# EAGLE schematic evpr (EAGLE 9.5.2)
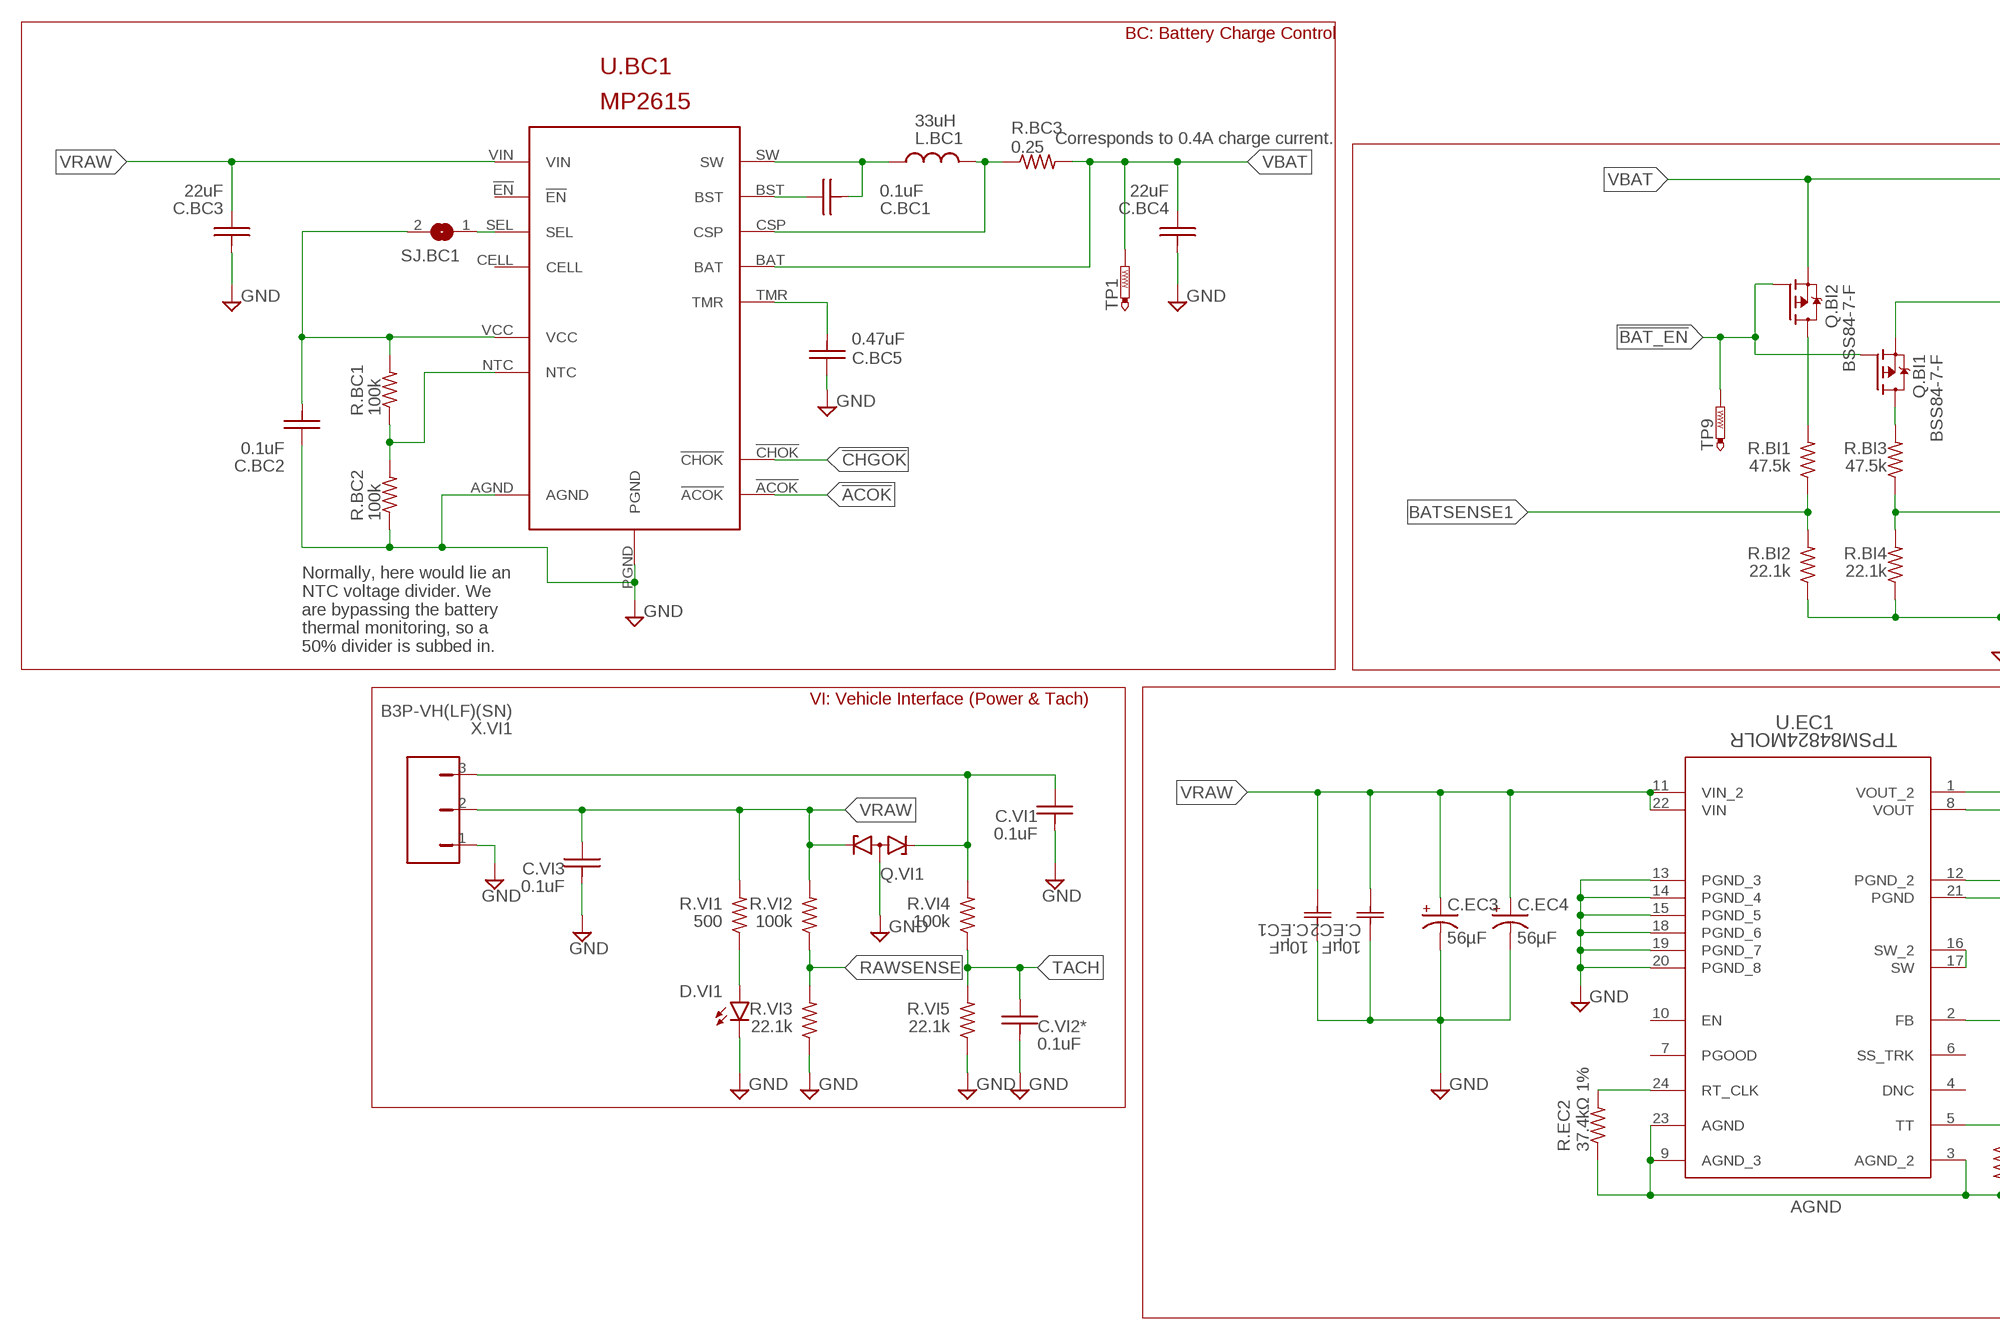
[diagram p0: schematic, sheet 1, part 1 of 2]
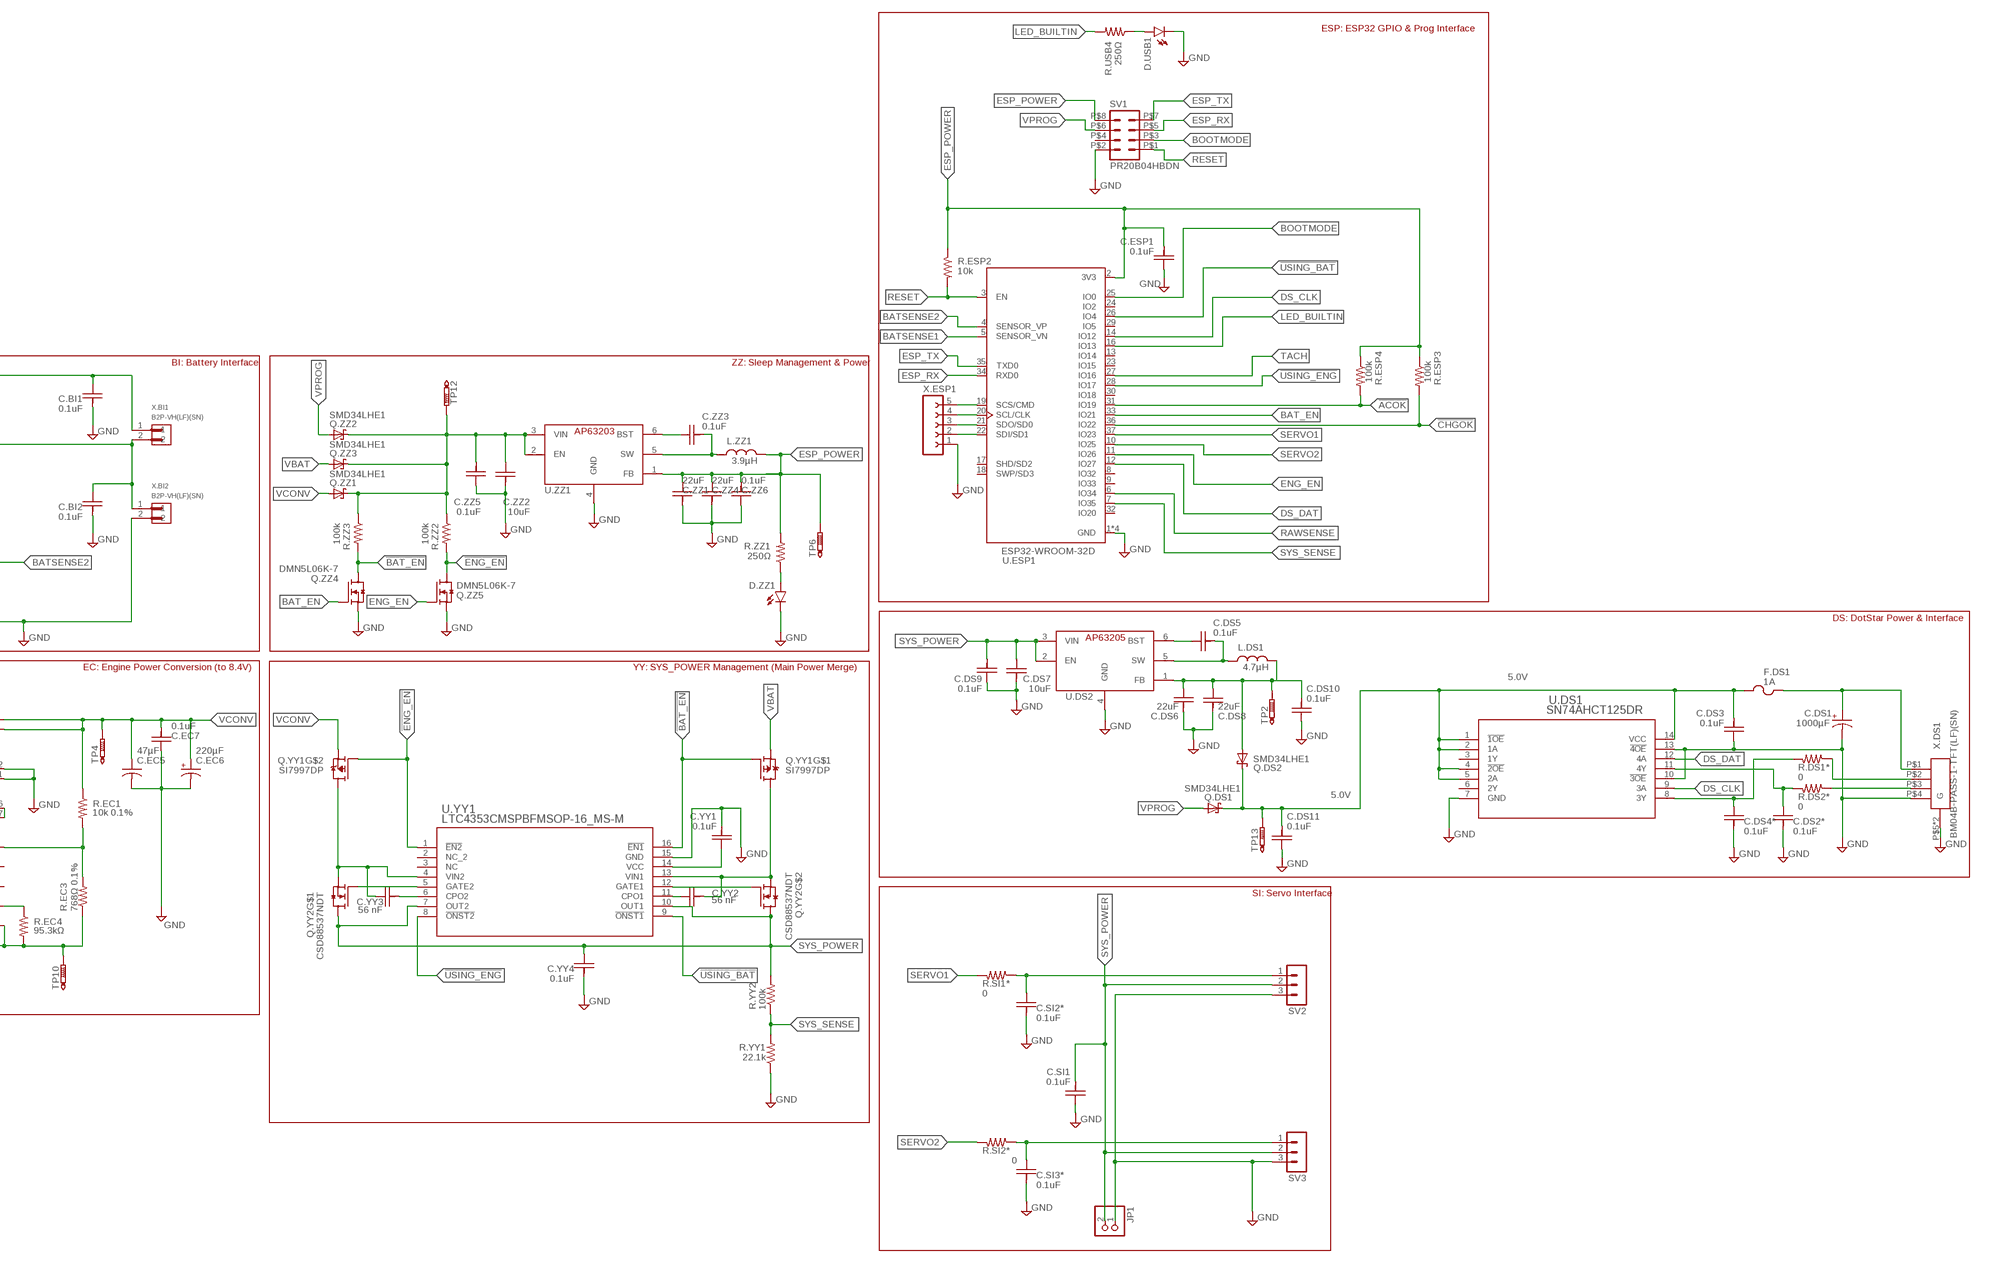
[diagram p1: schematic, sheet 1, part 2 of 2]

## Parts
C.BC1  0.1uF  C0603  [C0603]
C.BC2  0.1uF  C0603  [C0603]
C.BC3  22uF  C0603  [C0603]
C.BC4  22uF  C0603  [C0603]
C.BC5  0.47uF  C0603  [C0603]
C.BI1  0.1uF  C0603  [C0603]
C.BI2  0.1uF  C0603  [C0603]
C.DS1  1000µF  810RADCAP  [810RADCAN]
C.DS2*  0.1uF  C0603  [C0603]
C.DS3  0.1uF  C0603  [C0603]
C.DS4*  0.1uF  C0603  [C0603]
C.DS5  0.1uF  C0603  [C0603]
C.DS6  22uF  C0603  [C0603]
C.DS7  10uF  C0603  [C0603]
C.DS8  22uF  C0603  [C0603]
C.DS9  0.1uF  C0603  [C0603]
C.DS10  0.1uF  C0603  [C0603]
C.DS11  0.1uF  C0603  [C0603]
C.EC1  10µF  C3225X7R1E106K250AC  [CAP_3225]
C.EC2  10µF  C3225X7R1E106K250AC  [CAP_3225]
C.EC3  56µF  6.3MMCAP  [OSCON_SVPF_6.3MM]
C.EC4  56µF  6.3MMCAP  [OSCON_SVPF_6.3MM]
C.EC5  47µF  C-USC1210  [C1210]
C.EC6  220µF  WURTH875115352003  [C6CYLCAP]
C.EC7  0.1uF  C0603  [C0603]
C.ESP1  0.1uF  C0603  [C0603]
C.SI1  0.1uF  C0603  [C0603]
C.SI2*  0.1uF  C0603  [C0603]
C.SI3*  0.1uF  C0603  [C0603]
C.VI1  0.1uF  C0603  [C0603]
C.VI2*  0.1uF  C0603  [C0603]
C.VI3  0.1uF  C0603  [C0603]
C.YY1  0.1uF  C0603  [C0603]
C.YY2  56 nF  C0603  [C0603]
C.YY3  56 nF  C0603  [C0603]
C.YY4  0.1uF  C0603  [C0603]
C.ZZ1  22uF  C0603  [C0603]
C.ZZ2  10uF  C0603  [C0603]
C.ZZ3  0.1uF  C0603  [C0603]
C.ZZ4  22uF  C0603  [C0603]
C.ZZ5  0.1uF  C0603  [C0603]
C.ZZ6  0.1uF  C0603  [C0603]
D.USB1  LEDCHIP-LED0805  [CHIP-LED0805]
D.VI1  LEDCHIP-LED0805  [CHIP-LED0805]
D.ZZ1  LEDCHIP-LED0805  [CHIP-LED0805]
F.DS1  1A  C1Q_1C1-M  [C1-M]
JP1  PINHD-1X2  [1X02]
L.BC1  33uH  SRN5040TA-330M  [SRN5040TA]
L.DS1  4.7µH  SRR4818A-XXXX  [SRR4818A-XXXX]
L.ZZ1  3.9µH  SRR4818A-XXXX  [SRR4818A-XXXX]
Q.BI1  BSS84-7-F  [SOT23]
Q.BI2  BSS84-7-F  [SOT23]
Q.DS1  SMD34LHE1  [SOD-123HE1]
Q.DS2  SMD34LHE1  [SOD-123HE1]
Q.VI1  VESD16A2-03G-G3-08  [SOT23]
Q.YY1  SI7997DP  [POWERPAK_SO8DUAL]
Q.YY2  CSD88537NDT  [SOIC8]
Q.ZZ1  SMD34LHE1  [SOD-123HE1]
Q.ZZ2  SMD34LHE1  [SOD-123HE1]
Q.ZZ3  SMD34LHE1  [SOD-123HE1]
Q.ZZ4  DMN5L06K-7  [SOT23]
Q.ZZ5  DMN5L06K-7  [SOT23]
R.BC1  100k  R0603  [R0603]
R.BC2  100k  R0603  [R0603]
R.BC3  0.25  R0603  [R0603]
R.BI1  47.5k  R0603  [R0603]
R.BI2  22.1k  R0603  [R0603]
R.BI3  47.5k  R0603  [R0603]
R.BI4  22.1k  R0603  [R0603]
R.DS1*  0  R0603  [R0603]
R.DS2*  0  R0603  [R0603]
R.EC1  10k 0.1%  R0603  [R0603]
R.EC2  37.4kΩ 1%  R0603  [R0603]
R.EC3  768Ω 0.1%  R0603  [R0603]
R.EC4  95.3kΩ  R0603  [R0603]
R.ESP2  10k  R0603  [R0603]
R.ESP3  100k  R0603  [R0603]
R.ESP4  100k  R0603  [R0603]
R.SI1*  0  R0603  [R0603]
R.SI2*  0  R0603  [R0603]
R.USB4  250Ω  R0603  [R0603]
R.VI1  500  R0603  [R0603]
R.VI2  100k  R0603  [R0603]
R.VI3  22.1k  R0603  [R0603]
R.VI4  100k  R0603  [R0603]
R.VI5  22.1k  R0603  [R0603]
R.YY1  22.1k  R0603  [R0603]
R.YY2  100k  R0603  [R0603]
R.ZZ1  250Ω  R0603  [R0603]
R.ZZ2  100k  R0603  [R0603]
R.ZZ3  100k  R0603  [R0603]
SJ.BC1  SJ  [SJ]
SV1  PR20B04HBDN  [PR20B04HBDN]
SV2  MA03-1  [MA03-1]
SV3  MA03-1  [MA03-1]
TP1  PTR1TP10R  [TP10R]
TP2  PTR1TP10R  [TP10R]
TP4  PTR1TP10R  [TP10R]
TP6  PTR1TP10R  [TP10R]
TP9  PTR1TP10R  [TP10R]
TP10  PTR1TP10R  [TP10R]
TP12  PTR1TP10R  [TP10R]
TP13  PTR1TP10R  [TP10R]
U.BC1  MP2615  [QFN16]
U.DS1  SN74AHCT125DR  [D14]
U.DS2  AP63205  [TSOT23-6]
U.EC1  TPSM84824MOLR  [MOL0024A]
U.ESP1  ESP32-WROOM-32D  [MODULE_ESP32-WROOM-32D]
U.YY1  LTC4353CMSPBFMSOP-16_MS-M  [MSOP-16_MS-M]
U.ZZ1  AP63203  [TSOT23-6]
X.BI1  B2P-VH(LF)(SN)  [JST_B2P-VH(LF)(SN)]
X.BI2  B2P-VH(LF)(SN)  [JST_B2P-VH(LF)(SN)]
X.DS1  BM04B-PASS-1-TFT(LF)(SN)  [BM04B-PASS-1-TFT(LF)(SN)]
X.ESP1  FE05-1  [FE05-1]
X.VI1  B3P-VH(LF)(SN)  [B3P-VH]

## Nets
5.0V: C.DS3.2 C.DS11.2 F.DS1.1 Q.DS1.C Q.DS2.C TP13.TP U.DS1.1(!1OE) U.DS1.2(1A) U.DS1.4(!2OE) U.DS1.5(2A) U.DS1.14(VCC)
!ACOK: R.ESP4.2 U.BC1.!ACOK U.ESP1.31(IO19)
!BAT_EN: Q.BI1.1(G) Q.BI2.1(G) Q.YY1.P$2(G) Q.ZZ4.3(D) R.ZZ3.2 TP9.TP U.YY1.16(!EN1)
!CHGOK: R.ESP3.2 U.BC1.!CHOK U.ESP1.36(IO22)
!ENG_EN: Q.YY1.P$4(G) Q.ZZ5.3(D) R.ZZ2.2 U.YY1.1(!EN2)
!USING_BAT: U.ESP1.26(IO4) U.YY1.9(!ONST1)
!USING_ENG: U.ESP1.28(IO17) U.YY1.8(!ONST2)
AGND: R.EC2.1 R.EC3.1 R.EC4.2 TP10.TP U.EC1.3(AGND_2) U.EC1.9(AGND_3) U.EC1.23(AGND)
BAT_EN: Q.ZZ4.1(G) U.ESP1.33(IO21)
BATSENSE1: R.BI1.1 R.BI2.2 U.ESP1.5(SENSOR_VN)
BATSENSE2: R.BI3.1 R.BI4.2 U.ESP1.4(SENSOR_VP)
BOOTMODE: SV1.P$3 U.ESP1.25(IO0)
DS_CLK: U.DS1.9(3A) U.ESP1.14(IO12)
DS_DAT: U.DS1.12(4A) U.ESP1.12(IO27)
ENG_EN: Q.ZZ5.1(G) U.ESP1.11(IO26)
ESP_POWER: C.ESP1.2 C.ZZ1.1 C.ZZ4.1 C.ZZ6.2 L.ZZ1.P$2 R.ESP2.1 R.ESP3.1 R.ESP4.1 R.ZZ1.2 SV1.P$8 TP6.TP U.ESP1.2(3V3) U.ZZ1.1(FB)
ESP_RX: SV1.P$5 U.ESP1.34(RXD0)
ESP_TX: SV1.P$7 U.ESP1.35(TXD0)
GND: C.BC2.1 C.BC3.2 C.BC4.2 C.BC5.1 C.BI1.2 C.BI2.2 C.DS1.C$2(-) C.DS2*.2 C.DS3.1 C.DS4*.2 C.DS6.2 C.DS7.2 C.DS8.2 C.DS9.1 C.DS10.1 C.DS11.1 C.EC1.1 C.EC2.1 C.EC3.- C.EC4.- C.EC5.2 C.EC6.P$1(-) C.EC7.1 C.ESP1.1 C.SI1.1 C.SI2*.2 C.SI3*.2 C.VI1.2 C.VI2*.2 C.VI3.2 C.YY1.2 C.YY4.2 C.ZZ1.2 C.ZZ2.2 C.ZZ4.2 C.ZZ5.1 C.ZZ6.1 D.USB1.C D.VI1.C D.ZZ1.C JP1.1 Q.VI1.3(AA) Q.ZZ4.2(S) Q.ZZ5.2(S) R.BC2.1 R.BI2.1 R.BI4.1 R.VI3.1 R.VI5.1 R.YY1.1 SV1.P$2 SV2.3 SV3.3 U.BC1.AGND U.BC1.PGND U.DS1.7(GND) U.DS1.10(!3OE) U.DS1.13(!4OE) U.DS2.4(GND) U.EC1.12(PGND_2) U.EC1.13(PGND_3) U.EC1.14(PGND_4) U.EC1.15(PGND_5) U.EC1.18(PGND_6) U.EC1.19(PGND_7) U.EC1.20(PGND_8) U.EC1.21(PGND) U.ESP1.1(GND) U.ESP1.15(GND) U.ESP1.38(GND) U.ESP1.39(GND) U.YY1.15(GND) U.ZZ1.4(GND) X.BI2.2 X.DS1.P$4 X.DS1.P$5(G) X.DS1.P$6(G) X.ESP1.1 X.VI1.1
LED_BUILTIN: R.USB4.2 U.ESP1.16(IO13)
N$3: R.EC1.2 R.EC3.2 U.EC1.2(FB)
N$4: Q.YY2.4(G) U.YY1.12(GATE1)
N$5: C.YY3.1 Q.YY1.D$2A(D) Q.YY2.1(S) U.YY1.4(VIN2)
N$6: C.YY2.2 Q.YY1.D$1B(D) Q.YY2.3(S) U.YY1.13(VIN1)
N$7: C.BC5.2 U.BC1.TMR
N$8: C.BI2.1 Q.BI1.2(S) X.BI1.2 X.BI2.1
N$9: C.ZZ2.1 C.ZZ5.2 Q.ZZ1.C Q.ZZ2.C Q.ZZ3.C R.ZZ2.1 R.ZZ3.1 TP12.TP U.ZZ1.2(EN) U.ZZ1.3(VIN)
N$10: Q.YY2.2(G) U.YY1.5(GATE2)
N$11: C.SI2*.1 R.SI1*.1 SV2.1
N$12: C.SI3*.1 R.SI2*.1 SV3.1
N$13: Q.BI2.3(D) R.BI1.2
N$14: C.ZZ3.1 U.ZZ1.6(BST)
N$15: U.EC1.16(SW_2) U.EC1.17(SW)
N$17: R.EC2.2 U.EC1.24(RT_CLK)
N$22: C.DS2*.1 R.DS2*.2 U.DS1.11(4Y)
N$23: D.VI1.A R.VI1.1
N$24: D.USB1.A R.USB4.1
N$26: C.ZZ3.2 L.ZZ1.P$1 U.ZZ1.5(SW)
N$27: C.DS4*.1 R.DS1*.2 U.DS1.8(3Y)
N$28: C.DS1.A$1(+) F.DS1.2 X.DS1.P$1
N$29: C.DS5.1 U.DS2.6(BST)
N$30: R.DS1*.1 X.DS1.P$2
N$31: R.EC4.1 U.EC1.5(TT)
N$32: C.YY1.1 U.YY1.14(VCC)
N$33: Q.BI1.3(D) R.BI3.2
N$36: D.ZZ1.A R.ZZ1.1
N$37: C.YY2.1 U.YY1.11(CPO1)
N$38: C.YY3.2 U.YY1.6(CPO2)
N$42: R.DS2*.1 X.DS1.P$3
N$48: R.BC1.1 R.BC2.2 U.BC1.NTC
N$49: U.ESP1.19(SCS/CMD) X.ESP1.5
N$50: C.DS5.2 L.DS1.P$1 U.DS2.5(SW)
N$51: C.DS6.1 C.DS8.1 C.DS10.2 L.DS1.P$2 Q.DS2.A TP2.TP U.DS2.1(FB)
N$52: C.BC2.2 R.BC1.2 SJ.BC1.2 U.BC1.VCC
N$56: L.BC1.P$2 R.BC3.1 U.BC1.CSP
N$58: SJ.BC1.1 U.BC1.SEL
N$59: C.BC1.1 U.BC1.BST
N$60: C.BC1.2 L.BC1.P$1 U.BC1.SW
N$66: U.ESP1.20(SCL/CLK) X.ESP1.4
N$68: U.ESP1.21(SDO/SD0) X.ESP1.3
N$70: U.ESP1.22(SDI/SD1) X.ESP1.2
RAWSENSE: R.VI2.1 R.VI3.2 U.ESP1.6(IO34)
RESET: R.ESP2.2 SV1.P$1 U.ESP1.3(EN)
SERVO1: R.SI1*.2 U.ESP1.37(IO23)
SERVO2: R.SI2*.2 U.ESP1.10(IO25)
SYS_POWER: C.DS7.1 C.DS9.2 C.SI1.2 C.YY4.1 JP1.2 Q.YY2.5(D) Q.YY2.6(D) Q.YY2.7(D) Q.YY2.8(D) R.YY2.2 SV2.2 SV3.2 U.DS2.2(EN) U.DS2.3(VIN) U.YY1.7(OUT2) U.YY1.10(OUT1)
SYS_SENSE: R.YY1.2 R.YY2.1 U.ESP1.7(IO35)
TACH: C.VI2*.1 R.VI4.1 R.VI5.2 U.ESP1.27(IO16)
TACH_RAW: C.VI1.1 Q.VI1.2(K1) R.VI4.2 X.VI1.3
VBAT: C.BC4.1 C.BI1.1 Q.BI2.2(S) Q.YY1.P$1(S) Q.ZZ3.A R.BC3.2 TP1.TP U.BC1.BAT X.BI1.1
VCONV: C.EC5.1 C.EC6.P$2(+) C.EC7.2 Q.YY1.P$3(S) Q.ZZ1.A R.EC1.1 TP4.TP U.EC1.1(VOUT_2) U.EC1.8(VOUT)
VPROG: Q.DS1.A Q.ZZ2.A SV1.P$6
VRAW: C.BC3.1 C.EC1.2 C.EC2.2 C.EC3.+ C.EC4.+ C.VI3.1 Q.VI1.1(K2) R.VI1.2 R.VI2.2 U.BC1.VIN U.EC1.11(VIN_2) U.EC1.22(VIN) X.VI1.2
Unconnected: SV1.P$4 U.BC1.!EN U.BC1.CELL U.DS1.3(1Y) U.DS1.6(2Y) U.EC1.4(DNC) U.EC1.6(SS_TRK) U.EC1.7(PGOOD) U.EC1.10(EN) U.ESP1.8(IO32) U.ESP1.9(IO33) U.ESP1.13(IO14) U.ESP1.17(SHD/SD2) U.ESP1.18(SWP/SD3) U.ESP1.23(IO15) U.ESP1.24(IO2) U.ESP1.29(IO5) U.ESP1.30(IO18) U.ESP1.32(IO20) U.YY1.2(NC_2) U.YY1.3(NC)

## Notes on the sheet
- ESP: ESP32 GPIO & Prog Interface
- BC: Battery Charge Control
- Corresponds to 0.4A charge current.
- BI: Battery Interface | ZZ: Sleep Management & Power
- DS: DotStar Power & Interface
- Normally, here would lie an
  NTC voltage divider. We
  are bypassing the battery
  thermal monitoring, so a 
  50% divider is subbed in.
- VI: Vehicle Interface (Power & Tach) | EC: Engine Power Conversion (to 8.4V) | YY: SYS_POWER Management (Main Power Merge)
- SI: Servo Interface

## Library data of the parts
C.BC1 C.BC2 C.BI1 C.BI2 C.DS2* C.DS3 C.DS4* C.DS5 C.DS9-C.DS11 C.EC7 C.ESP1 C.SI1 C.SI2* C.SI3* C.VI1 C.VI2* C.VI3 C.YY1 C.YY4 C.ZZ3 C.ZZ5 C.ZZ6 = mccloud:C0603: CAPACITOR, American symbol; COMPONENT: 06033C104JAT2A
C.BC3 C.BC4 C.DS6 C.DS8 C.ZZ1 C.ZZ4 = mccloud:C0603: CAPACITOR, American symbol; COMPONENT: CL10A226MO7JZNC
C.BC5 = mccloud:C0603: CAPACITOR, American symbol; COMPONENT: C0603C474K4PACTU
C.DS1 = mccloud:810RADCAP; COMPONENT: UWT0J102MNL1GS
C.DS7 C.ZZ2 = mccloud:C0603: CAPACITOR, American symbol; COMPONENT: GRM188R61E106MA73J
C.EC1 C.EC2 = mccloud:C3225X7R1E106K250AC; COMPONENT: C3225X7R1E106K250AC
C.EC3 C.EC4 = mccloud:6.3MMCAP; COMPONENT: APXG250ARA560MF61G
C.EC5 = rcl:C-US: CAPACITOR, American symbol; COMPONENT: CL32A476KOJNNNE; SPICEPREFIX: C
C.EC6 = mccloud:WURTH875115352003; COMPONENT: 875075355002
C.YY2 C.YY3 = mccloud:C0603: CAPACITOR, American symbol; COMPONENT: CL10B562KB8NNNC
D.USB1 D.VI1 D.ZZ1 = led:LED: LED OSRAM: - CHIPLED LG R971, LG N971, LY N971, LG Q971, LY Q971, LO R971, LY R971 LH N974, LH R974 LS Q976, LO Q976, LY Q976 LO Q996 - Hyper CHIPLED LW Q18S LB Q993, LB Q99A, LB R99A - SideLED LS A670, LO A670, LY A670, LG A670, LP A670 LB A673, LV A673, LT A673, LW A673 LH A674 LY A675 LS A676, LA A676, LO A676, LY A676, LW A676 LS A679, LY A679, LG A679 - Hyper Micro SIDELED® LS Y876, LA Y876, LO Y876, LY Y876 LT Y87S - SmartLED LW L88C, LW L88S LB L89C, LB L89S, LG L890 LS L89K, LO L89K, LY L89K LS L896, LA L896, LO L896, LY L896 - TOPLED LS T670, LO T670, LY T670, LG T670, LP T670 LSG T670, LSP T670, LSY T670, LOP T670, LYG T670 LG T671, LOG T671, LSG T671 LB T673, LV T673, LT T673, LW T673 LH T674 LS T676, LA T676, LO T676, LY T676, LB T676, LH T676, LSB T676, LW T676 LB T67C, LV T67C, LT T67C, LS T67K, LO T67K, LY T67K, LW E67C LS E67B, LA E67B, LO E67B, LY E67B, LB E67C, LV E67C, LT E67C LW T67C LS T679, LY T679, LG T679 LS T770, LO T770, LY T770, LG T770, LP T770 LB T773, LV T773, LT T773, LW T773 LH T774 LS E675, LA E675, LY E675, LS T675 LS T776, LA T776, LO T776, LY T776, LB T776 LHGB T686 LT T68C, LB T68C - Hyper Mini TOPLED® LB M676 - Mini TOPLED Santana® LG M470 LS M47K, LO M47K, LY M47K Source: http://www.osram.convergy.de LUXEON: - LUMILED® LXK2-PW12-R00, LXK2-PW12-S00, LXK2-PW14-U00, LXK2-PW14-V00 LXK2-PM12-R00, LXK2-PM12-S00, LXK2-PM14-U00 LXK2-PE12-Q00, LXK2-PE12-R00, LXK2-PE12-S00, LXK2-PE14-T00, LXK2-PE14-U00 LXK2-PB12-K00, LXK2-PB12-L00, LXK2-PB12-M00, LXK2-PB14-N00, LXK2-PB14-P00, LXK2-PB14-Q00 LXK2-PR12-L00, LXK2-PR12-M00, LXK2-PR14-Q00, LXK2-PR14-R00 LXK2-PD12-Q00, LXK2-PD12-R00, LXK2-PD12-S00 LXK2-PH12-R00, LXK2-PH12-S00 LXK2-PL12-P00, LXK2-PL12-Q00, LXK2-PL12-R00 Source: www.luxeon.com KINGBRIGHT: KA-3528ASYC Source: www.kingbright.com; COMPONENT: LTST-C171GKT
F.DS1 = mccloud:C1Q_1; COMPONENT: C1Q 1; MANUFACTURER_PART_NUMBER: C1Q 1; VENDOR: BelFuse
JP1 = pinhead:PINHD-1X2: PIN HEADER
L.BC1 = mccloud:SRN5040TA-330M; COMPONENT: SRN5040TA-330M
L.DS1 L.ZZ1 = mccloud:SRR4818A-XXXX; COMPONENT: SRR4818A-3R9Y
Q.BI1 Q.BI2 = mccloud:BSS84-7-F; COMPONENT: BSS84-7-F
Q.DS1 Q.DS2 Q.ZZ1-Q.ZZ3 = mccloud:SMD34LHE1; COMPONENT: SMD34LHE1-TP
Q.VI1 = mccloud:VESD16A2-03G-G3-08; COMPONENT: VESD16A2-03G-G3-08
Q.YY1 = mccloud:SI7997DP; COMPONENT: SI7997DP
Q.YY2 = mccloud:CSD88537NDT; COMPONENT: CSD88537NDT
Q.ZZ4 Q.ZZ5 = mccloud:DMN5L06K-7; COMPONENT: DMN5L06K-7
R.BC1 R.BC2 R.ESP3 R.ESP4 R.VI2 R.VI4 R.YY2 R.ZZ2 R.ZZ3 = mccloud:R0603: RESISTOR, American symbol; COMPONENT: RMCF0603FT100K; SPICEPREFIX: R
R.BC3 = mccloud:R0603: RESISTOR, American symbol; COMPONENT: CSR0603FKR250; SPICEPREFIX: R
R.BI1 R.BI3 = mccloud:R0603: RESISTOR, American symbol; COMPONENT: RMCF0603FT47K5; SPICEPREFIX: R
R.BI2 R.BI4 R.VI3 R.VI5 R.YY1 = mccloud:R0603: RESISTOR, American symbol; COMPONENT: RMCF0603FT22K1; SPICEPREFIX: R
R.DS1* R.DS2* R.SI1* R.SI2* = mccloud:R0603: RESISTOR, American symbol; COMPONENT: RMCF0603FG1M00; SPICEPREFIX: R
R.EC1 = mccloud:R0603: RESISTOR, American symbol; COMPONENT: RG1608P-103-B-T5; SPICEPREFIX: R
R.EC2 = mccloud:R0603: RESISTOR, American symbol; COMPONENT: RC0603FR-0737K4L; SPICEPREFIX: R
R.EC3 = mccloud:R0603: RESISTOR, American symbol; COMPONENT: RQ73C1J768RBTD; SPICEPREFIX: R
R.EC4 = mccloud:R0603: RESISTOR, American symbol; COMPONENT: RMCF0603FT95K3; SPICEPREFIX: R
R.ESP2 = mccloud:R0603: RESISTOR, American symbol; COMPONENT: RMCF0603FT10K0; SPICEPREFIX: R
R.USB4 R.ZZ1 = mccloud:R0603: RESISTOR, American symbol; COMPONENT: RMCF0603JT300R; SPICEPREFIX: R
R.VI1 = mccloud:R0603: RESISTOR, American symbol; COMPONENT: RMCF0603FT1K00; SPICEPREFIX: R
SJ.BC1 = jumper:SJ: SMD solder JUMPER
SV1 = mccloud:PR20B04HBDN
SV2 SV3 = con-lstb:MA03-1: PIN HEADER; OC_FARNELL: unknown; OC_NEWARK: unknown
TP1 TP2 TP4 TP6 TP9 TP10 TP12 TP13 = testpad:PTR1: TEST PIN
U.BC1 = mccloud:MP2615; COMPONENT: MP2615
U.DS1 = mccloud:SN74AHCT125DR; COMPONENT: SN74AHCT125DR; MANUFACTURER_PART_NUMBER: SN74AHCT125DR; VENDOR: Vendor
U.DS2 = mccloud:AP63205; COMPONENT: AP63205WU-7
U.EC1 = mccloud:TPSM84824MOLR; COMPONENT: TPSM84824MOLR; MANUFACTURER_PART_NUMBER: TPSM84824MOLR; VENDOR: Texas Instruments
U.ESP1 = mccloud:ESP32-WROOM-32D: IC: SoC; GPIO, I2C, I2S, IR, SD, SDIO, SPI, UART; 2.7÷3.6VDC; 20dBm; AVAILABILITY: Unavailable; COMPONENT: ESP32-WROOM-32D; DESCRIPTION: IC: SoC; GPIO, I2C, I2S, IR, SD, SDIO, SPI, UART; 2.7÷3.6VDC; 20dBm; MF: Espressif Systems; MP: ESP32-WROOM-32D; PACKAGE: Module Espressif Systems; PRICE: None
U.YY1 = mccloud:LTC4353CMSPBF; COMPONENT: LTC4353CMS#PBF; MANUFACTURER_PART_NUMBER: LTC4353CMS#PBF; VENDOR: Linear Technology
U.ZZ1 = mccloud:AP63203; COMPONENT: AP63203WU-7
X.BI1 X.BI2 = B2P-VH_LF__SN_:B2P-VH(LF)(SN): VH Series 3.96 mm Pitch, Compact, Lock Mechanism also Prevents Misinsertion; AVAILABILITY: Unavailable; COMPONENT: B2P-VH(LF)(SN); DESCRIPTION: VH Series 3.96 mm Pitch, Compact, Lock Mechanism also Prevents Misinsertion; MF: JST Sales; MP: B2P-VH_LF__SN_; PACKAGE: FakePackage u; PRICE: None
X.DS1 = mccloud:BM04B-PASS-1-TFT(LF)(SN); COMPONENT: BM04B-PASS-1-TFT(LF)(SN)
X.ESP1 = con-lsta:FE05-1: FEMALE HEADER; OC_FARNELL: unknown; OC_NEWARK: unknown
X.VI1 = B3P-VH_LF__SN_:B3P-VH(LF)(SN): http://octopart.com/b3p-vh%28lf%29%28sn%29-jst-248804; AVAILABILITY: Unavailable; COMPONENT: B3P-VH(LF)(SN); DESCRIPTION: VH Series 3 Position 3.96 mm Pitch Through Hole Crimp Locking Header; MF: JST Sales; MP: B3P-VH_LF__SN_; PACKAGE: FakePackage u; PRICE: None